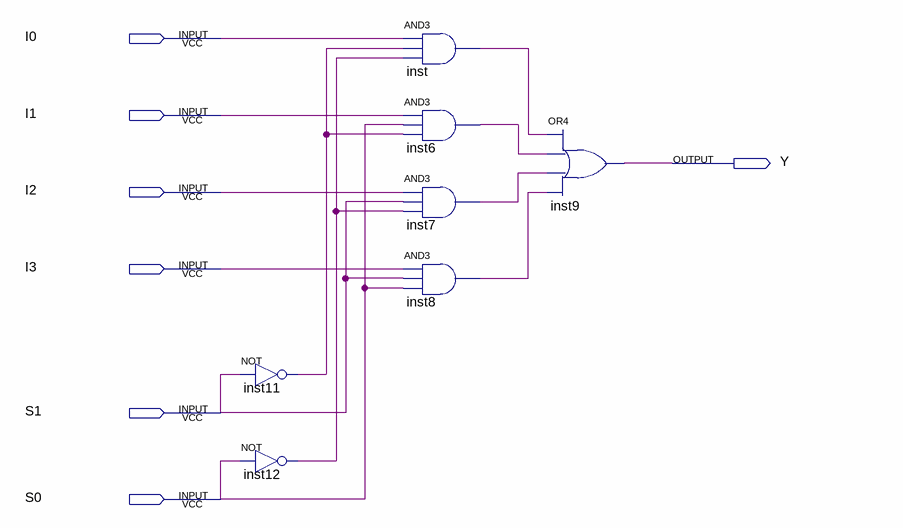
[diagram p0: schematic sheet]
// Quartus schematic 41MUX.bdf as structural Verilog: 7 symbols, 7 pins
module \41MUX  (
  input  I0,
  input  I1,
  input  I2,
  input  I3,
  input  S1,
  input  S0,
  output Y
);

  wire inst6_out, inst7_out, inst8_out, inst11_out, inst12_out, inst_out;

  not inst11 (inst11_out, S1);
  not inst12 (inst12_out, S0);
  and inst (inst_out, I0, inst11_out, inst12_out);
  and inst6 (inst6_out, I1, S0, inst11_out);
  and inst7 (inst7_out, I2, S1, inst12_out);
  and inst8 (inst8_out, I3, S1, S0);
  or inst9 (Y, inst_out, inst6_out, inst7_out, inst8_out);
endmodule
